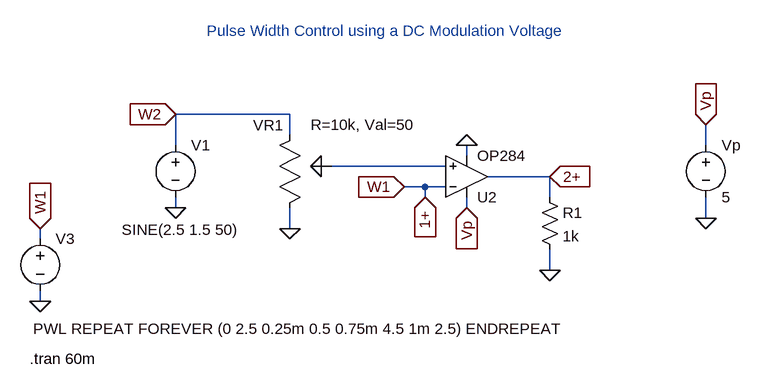
[diagram p0: schematic pwm_dc_modulation_ltspice.asc]
pwm_dc_modulation_ltspice.asc, the LTspice schematic file:
Version 4
SHEET 1 932 888
WIRE 96 208 -80 208
WIRE 96 240 96 208
WIRE -80 256 -80 208
WIRE 736 256 736 224
WIRE 368 272 368 256
WIRE 336 288 160 288
WIRE 496 304 400 304
WIRE 304 320 272 320
WIRE 336 320 304 320
WIRE 304 336 304 320
WIRE 496 336 496 304
WIRE -80 352 -80 336
WIRE 368 352 368 336
WIRE 736 368 736 336
WIRE 96 384 96 352
WIRE -288 400 -288 384
WIRE 496 448 496 416
WIRE -288 496 -288 480
FLAG 368 256 0
FLAG -80 208 W2
IOPIN -80 208 In
FLAG 272 320 W1
IOPIN 272 320 In
FLAG 496 448 0
FLAG 496 304 2+
IOPIN 496 304 In
FLAG 304 336 1+
IOPIN 304 336 In
FLAG -80 352 0
FLAG -288 384 W1
IOPIN -288 384 In
FLAG -288 496 0
FLAG 736 368 0
FLAG 96 384 0
FLAG 736 224 Vp
IOPIN 736 224 In
FLAG 368 352 Vp
IOPIN 368 352 In
SYMBOL res 480 320 R0
SYMATTR InstName R1
SYMATTR Value 1k
SYMBOL voltage -80 240 R0
WINDOW 3 -83 146 Left 2
WINDOW 123 0 0 Left 0
WINDOW 39 0 0 Left 0
SYMATTR Value SINE(2.5 1.5 50)
SYMATTR InstName V1
SYMBOL voltage 736 240 R0
WINDOW 123 0 0 Left 0
WINDOW 39 0 0 Left 0
SYMATTR InstName Vp
SYMATTR Value 5
SYMBOL voltage -288 384 R0
WINDOW 3 -11 154 Left 2
SYMATTR Value PWL REPEAT FOREVER (0 2.5 0.25m 0.5 0.75m 4.5 1m 2.5) ENDREPEAT
SYMATTR InstName V3
SYMBOL potentiometer 112 256 M0
WINDOW 0 26 -31 Left 2
WINDOW 39 -176 -32 Left 2
SYMATTR InstName VR1
SYMATTR SpiceLine R=10k, Val=50
SYMBOL Opamps\\OP284 368 368 M180
SYMATTR InstName U2
TEXT -32 80 Left 2 ;Pulse Width Control using a DC Modulation Voltage
TEXT -304 584 Left 2 !.tran 60m

The netlist it stands for:
* pwm_dc_modulation_ltspice.asc
R1 2+ 0 1k
V1 W2 0 SINE(2.5 1.5 50)
Vp Vp 0 5
V3 1+ 0 PWL REPEAT FOREVER (0 2.5 0.25m 0.5 0.75m 4.5 1m 2.5) ENDREPEAT
XVR1 W2 N001 0 potentiometer R=10k, Val=50  ; pins 1 2 3
XU2 N001 1+ Vp 0 2+ OP284  ; pins In+ In- V+ V- OUT
* Pulse Width Control using a DC Modulation Voltage
.tran 60m
.lib ADI1.lib
.backanno
.end